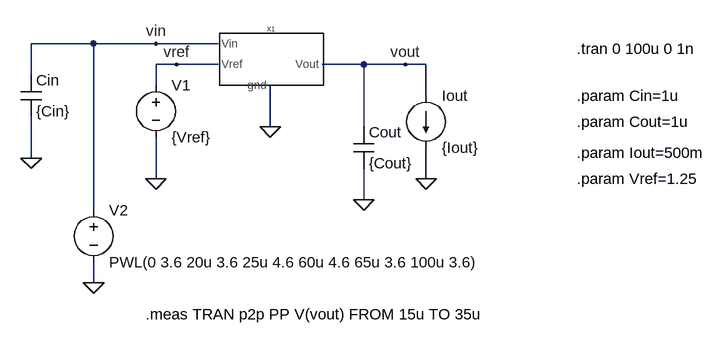
[diagram p0: schematic Line Transient_6p27.asc]
Line Transient_6p27.asc, the LTspice schematic file:
Version 4
SHEET 1 1160 680
WIRE -48 32 -144 32
WIRE 48 32 -48 32
WIRE 144 32 48 32
WIRE 80 64 48 64
WIRE 144 64 80 64
WIRE 368 64 304 64
WIRE 432 64 368 64
WIRE 464 64 432 64
WIRE -144 80 -144 32
WIRE 48 96 48 64
WIRE 464 112 464 64
WIRE 224 160 224 96
WIRE 368 160 368 64
WIRE -144 208 -144 144
WIRE 48 240 48 176
WIRE 464 240 464 192
WIRE 368 272 368 224
WIRE -48 288 -48 32
WIRE -48 400 -48 368
FLAG 80 64 vref
FLAG 48 32 vin
FLAG 368 272 0
FLAG 464 240 0
FLAG 432 64 vout
FLAG 224 160 0
FLAG -48 400 0
FLAG -144 208 0
FLAG 48 240 0
SYMBOL LDO_basic 224 48 R0
SYMATTR InstName X1
SYMBOL voltage 48 80 R0
WINDOW 123 0 0 Left 0
WINDOW 39 0 0 Left 0
SYMATTR InstName V1
SYMATTR Value {Vref}
SYMBOL cap 352 160 R0
SYMATTR InstName Cout
SYMATTR Value {Cout}
SYMBOL current 464 112 R0
WINDOW 123 0 0 Left 0
WINDOW 39 0 0 Left 0
SYMATTR InstName Iout
SYMATTR Value {Iout}
SYMBOL voltage -48 272 R0
WINDOW 123 24 44 Left 2
WINDOW 39 0 0 Left 0
SYMATTR InstName V2
SYMATTR Value PWL(0 3.6 20u 3.6 25u 4.6 60u 4.6 65u 3.6 100u 3.6)
SYMBOL cap -160 80 R0
SYMATTR InstName Cin
SYMATTR Value {Cin}
TEXT 696 40 Left 2 !.tran 0 100u 0 1n
TEXT 696 200 Left 2 !.param Iout=500m
TEXT 696 152 Left 2 !.param Cout=1u
TEXT 696 112 Left 2 !.param Cin=1u
TEXT 696 240 Left 2 !.param Vref=1.25
TEXT 32 448 Left 2 !.meas TRAN p2p PP V(vout) FROM 15u TO 35u

The netlist it stands for:
* Line Transient_6p27.asc
XX1 vin vref 0 vout LDO_basic  ; pins Vin Vref gnd Vout
V1 vref 0 {Vref}
Cout vout 0 {Cout}
Iout vout 0 {Iout}
V2 vin 0 PWL(0 3.6 20u 3.6 25u 4.6 60u 4.6 65u 3.6 100u 3.6)
Cin vin 0 {Cin}
.tran 0 100u 0 1n
.param Iout=500m
.param Cout=1u
.param Cin=1u
.param Vref=1.25
.meas TRAN p2p PP V(vout) FROM 15u TO 35u
.backanno
.end